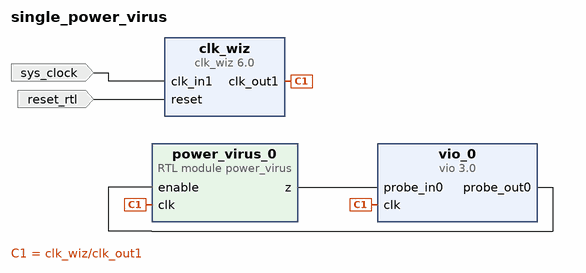
[diagram p0: block diagram of the top level]
# Vivado block design single_power_virus, xc7z010clg400-1, Vivado 2020.1
create_bd_design single_power_virus

create_bd_port -dir I -type clk sys_clock
set_property -dict {CONFIG.FREQ_HZ 125000000 CONFIG.PHASE 0.000} [get_bd_ports sys_clock]
create_bd_port -dir I -type rst reset_rtl
set_property -dict {CONFIG.POLARITY ACTIVE_HIGH} [get_bd_ports reset_rtl]

create_bd_cell -type ip -vlnv xilinx.com:ip:vio:3.0 vio_0
create_bd_cell -type ip -vlnv xilinx.com:ip:clk_wiz:6.0 clk_wiz
set_property -dict {CONFIG.CLK_IN1_BOARD_INTERFACE sys_clock CONFIG.USE_BOARD_FLOW true} [get_bd_cells clk_wiz]
create_bd_cell -type module -reference power_virus power_virus_0

# ---- connections ----

connect_bd_net [get_bd_pins clk_wiz/clk_out1] [get_bd_pins vio_0/clk] [get_bd_pins power_virus_0/clk]
connect_bd_net [get_bd_pins vio_0/probe_out0] [get_bd_pins power_virus_0/enable]
connect_bd_net [get_bd_pins power_virus_0/z] [get_bd_pins vio_0/probe_in0]
connect_bd_net [get_bd_ports sys_clock] [get_bd_pins clk_wiz/clk_in1]
connect_bd_net [get_bd_ports reset_rtl] [get_bd_pins clk_wiz/reset]

validate_bd_design
save_bd_design
